# EAGLE schematic Buck_Convertor_Design (EAGLE 9.6.2)
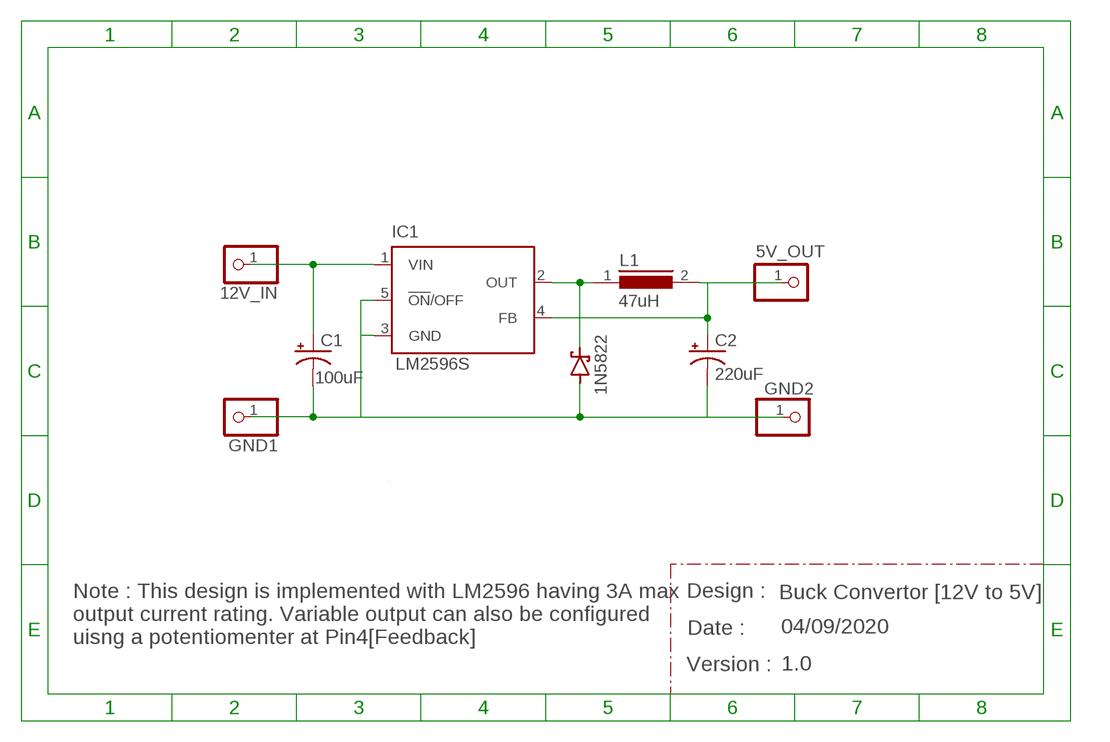
[diagram p0: schematic, sheet 1]

## Parts
5V_OUT  PINHD-1X1  [1X01]
12V_IN  PINHD-1X1  [1X01]
C1  100uF  CPOL-US140CLH-1010  [140CLH-1010]
C2  220uF  CPOL-US140CLH-1010  [140CLH-1010]
D6  1N5822  SCHOTTKY-DIODESMC  [SMC]
GND1  PINHD-1X1  [1X01]
GND2  PINHD-1X1  [1X01]
IC1  LM2596S  [TO263-5]
L1  47uH  DR127  [DR127]

## Nets
N$1: 12V_IN.1 C1.+ IC1.1(VIN)
N$2: C1.- C2.- D6.A GND1.1 GND2.1 IC1.3(GND) IC1.5(!ON!/OFF)
N$3: D6.C IC1.2(OUT) L1.1
N$4: 5V_OUT.1 C2.+ IC1.4(FB) L1.2

## Notes on the sheet
- Design : | Buck Convertor [12V to 5V]
- Date : | 04/09/2020
- Note : This design is implemented with LM2596 having 3A max
  output current rating. Variable output can also be configured
  uisng a potentiomenter at Pin4[Feedback]
- Version : | 1.0

## Library data of the parts
5V_OUT 12V_IN GND1 GND2 = adafruit:PINHD-1X1: Pin header 1x1 for 0.1" spacing With round pins
C1 C2 = adafruit:CPOL-US: POLARIZED CAPACITOR, American symbol
D6 = diode:SCHOTTKY-DIODE: Schottky Diode
IC1 = national-semiconductor:LM2596: SIMPLE SWITCHER® Power Converter 150 kHz 3A Step-Down Voltage Regulator Source: http://www.national.com/ds/LM/LM2596.pdf; MF: NATIONAL SEMICONDUCTOR; MPN: LM2596S-ADJ/NOPB; OC_FARNELL: 9494367; OC_NEWARK: 41K3842
L1 = inductors:DR127: High Power Density, High Efficiency, Shielded Inductors Source: coiltronics_dr_series.pdf; SPICEPREFIX: L